# Altium project Mo04E_u2.PrjPCB
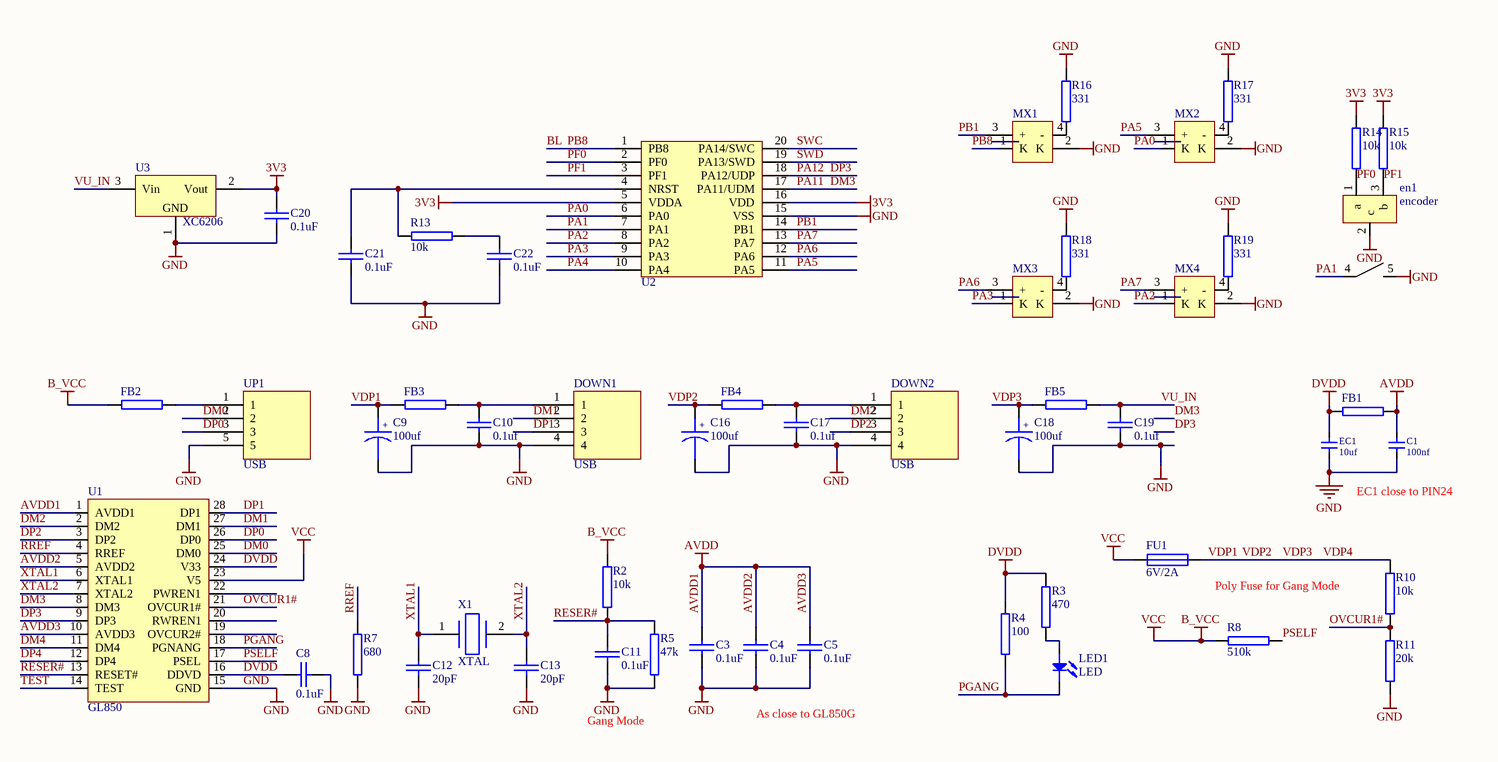
[diagram p0: Sheet1.SchDoc]
1 sheet, 52 parts. Net scope: global (net labels, ports and power ports of the same name join across sheets).
Board file: PCB1.PcbDoc

## Sheet Sheet1.SchDoc
size A3

### Parts
C1  100nf  [C0805]
C3  0.1uF  [C0805]
C4  0.1uF  [C0805]
C5  0.1uF  [C0805]
C8  0.1uF  [C0805]
C9  100uf  [C0805]
C10  0.1uf  [C0805]
C11  0.1uF  [C0805]
C12  20pF  [C0805]
C13  20pF  [C0805]
C16  100uf  [C0805]
C17  0.1uf  [C0805]
C18  100uf  [C0805]
C19  0.1uf  [C0805]
C20  0.1uF  [C0805]
C21  0.1uF  [C0805]
C22  0.1uF  [C0805]
DOWN1  USB  [USB-A/S_D]
DOWN2  USB  [USB-A/S_D]
EC1  10uf  [C0805]
en1  encoder  [RES ADJ-EC12]
FB1  (no value)  [R0805]
FB2  (no value)  [R0805]
FB3  (no value)  [R0805]
FB4  (no value)  [R0805]
FB5  (no value)  [R0805]
FU1  6V/2A  [FUSE-F1210]
LED1  LED  [LED0805]
MX1  (no value)  [MX_SW-5]
MX2  (no value)  [MX_SW-5]
MX3  (no value)  [MX_SW-5]
MX4  (no value)  [MX_SW-5]
R2  10k  [R0805]
R3  470  [R0805]
R4  100  [R0805]
R5  47k  [R0805]
R7  680  [R0805]
R8  510k  [R0805]
R10  10k  [R0805]
R11  20k  [R0805]
R13  10k  [R0805]
R14  10k  [R0805]
R15  10k  [R0805]
R16  331  [R0805]
R17  331  [R0805]
R18  331  [R0805]
R19  331  [R0805]
U1  GL850  [SSOP28]
U2  stm32f042Fx  [TSSOP20]  (value not drawn)
U3  XC6206  [SOT23-3]
UP1  USB  [USB-micro_B]
X1  XTAL  [X5032]

### Nets
3V3: C20.1 R14.2 R15.2 U2.5(VDDA) U2.16(VDD) U3.2(Vout)
AVDD1: C1.2 C3.1 C4.1 C5.1 FB1.2 U1.1(AVDD1) U1.5(AVDD2) U1.10(AVDD3)  [also labelled AVDD, AVDD2, AVDD3]
B_VCC: FB2.1 FU1.1 R2.2 R8.1 U1.23(V5)  [also labelled VCC]
DVDD: C8.1 EC1.2 FB1.1 R3.2 R4.2 U1.16(DDVD) U1.24(V33)
GND: C1.1 C3.2 C4.2 C5.2 C8.2 C9.2 C10.2 C11.2 C12.1 C13.1 C16.2 C17.2 C18.2 C19.2 C20.2 C21.1 C22.1 DOWN1.4 DOWN2.4 EC1.1 en1.2(c) en1.5 MX1.2(K) MX2.2(K) MX3.2(K) MX4.2(K) R5.2 R7.1 R11.1 R16.2 R17.2 R18.2 R19.2 U1.15(GND) U2.15(VSS) U3.1(GND) UP1.5
BL: MX1.1(K) U2.1(PB8)  [also labelled PB8]
DM0: U1.25(DM0) UP1.2
DM1: DOWN1.2 U1.27(DM1)
DM2: DOWN2.2 U1.2(DM2)
DM3: U1.8(DM3) U2.17(PA11/UDM)  [also labelled PA11]
DM4: U1.11(DM4)
DP0: U1.26(DP0) UP1.3
DP1: DOWN1.3 U1.28(DP1)
DP2: DOWN2.3 U1.3(DP2)
DP3: U1.9(DP3) U2.18(PA12/UDP)  [also labelled PA12]
DP4: U1.12(DP4)
OVCUR1#: R10.1 R11.2 U1.21(OVCUR1#)
PA0: MX2.1(K) U2.6(PA0)
PA1: en1.4 U2.7(PA1)
PA2: MX4.1(K) U2.8(PA2)
PA3: MX3.1(K) U2.9(PA3)
PA4: U2.10(PA4)
PA5: MX2.3(+) U2.11(PA5)
PA6: MX3.3(+) U2.12(PA6)
PA7: MX4.3(+) U2.13(PA7)
PB1: MX1.3(+) U2.14(PB1)
PF0: en1.1(a) R14.1 U2.2(PF0)
PF1: en1.3(b) R15.1 U2.3(PF1)
PGANG: LED1.2 R4.1 U1.18(PGNANG)
PSELF: R8.2 U1.17(PSEL)
RESER#: C11.1 R2.1 R5.1 U1.13(RESET#)
RREF: R7.2 U1.4(RREF)
SWC: U2.20(PA14/SWC)
SWD: U2.19(PA13/SWD)
TEST: U1.14(TEST)
VDP1: C9.1 C16.1 C18.1 FB3.1 FB4.1 FB5.1 FU1.2 R10.2  [also labelled VDP2, VDP3, VDP4]
VU_IN: C19.1 FB5.2 U3.3(Vin)
XTAL1: C12.2 U1.6(XTAL1) X1.1
XTAL2: C13.2 U1.7(XTAL2) X1.2
NetC10_1: C10.1 DOWN1.1 FB3.2
NetC17_1: C17.1 DOWN2.1 FB4.2
NetC21_2: C21.2 R13.1 U2.4(NRST)
NetC22_2: C22.2 R13.2
NetFB2_2: FB2.2 UP1.1
NetLED1_1: LED1.1 R3.1
NetMX1_4: MX1.4(-) R16.1
NetMX2_4: MX2.4(-) R17.1
NetMX3_4: MX3.4(-) R18.1
NetMX4_4: MX4.4(-) R19.1

Not connected (* = marked no-connect by the designer): U1 19(OVCUR2#) 20(RWREN1) 22(PWREN1)

### Notes on the sheet
- EC1 close to PIN24
- Poly Fuse for Gang Mode
- As close to GL850G
- Gang Mode
- (in symbol 电解电容) +

### Library data of the parts
C1 EC1 = CAP: Capacitor
C3-C5 C8 C10-C13 C17 C19-C22 = CAP
C9 C16 C18 = 电解电容: Capacitor
DOWN1 DOWN2 UP1 = USB: 4 Pin Header
FB1-FB5 R8 R10 R11 R16-R19 = R
FU1 = FUSE
MX1-MX4 = MX_SW-7
R2-R5 R7 R13-R15 = RES
X1 = XTAL: 12M